# EAGLE schematic Billy-Bass-Board v75 (EAGLE 9.7.0)

## Sheet 1 of 4
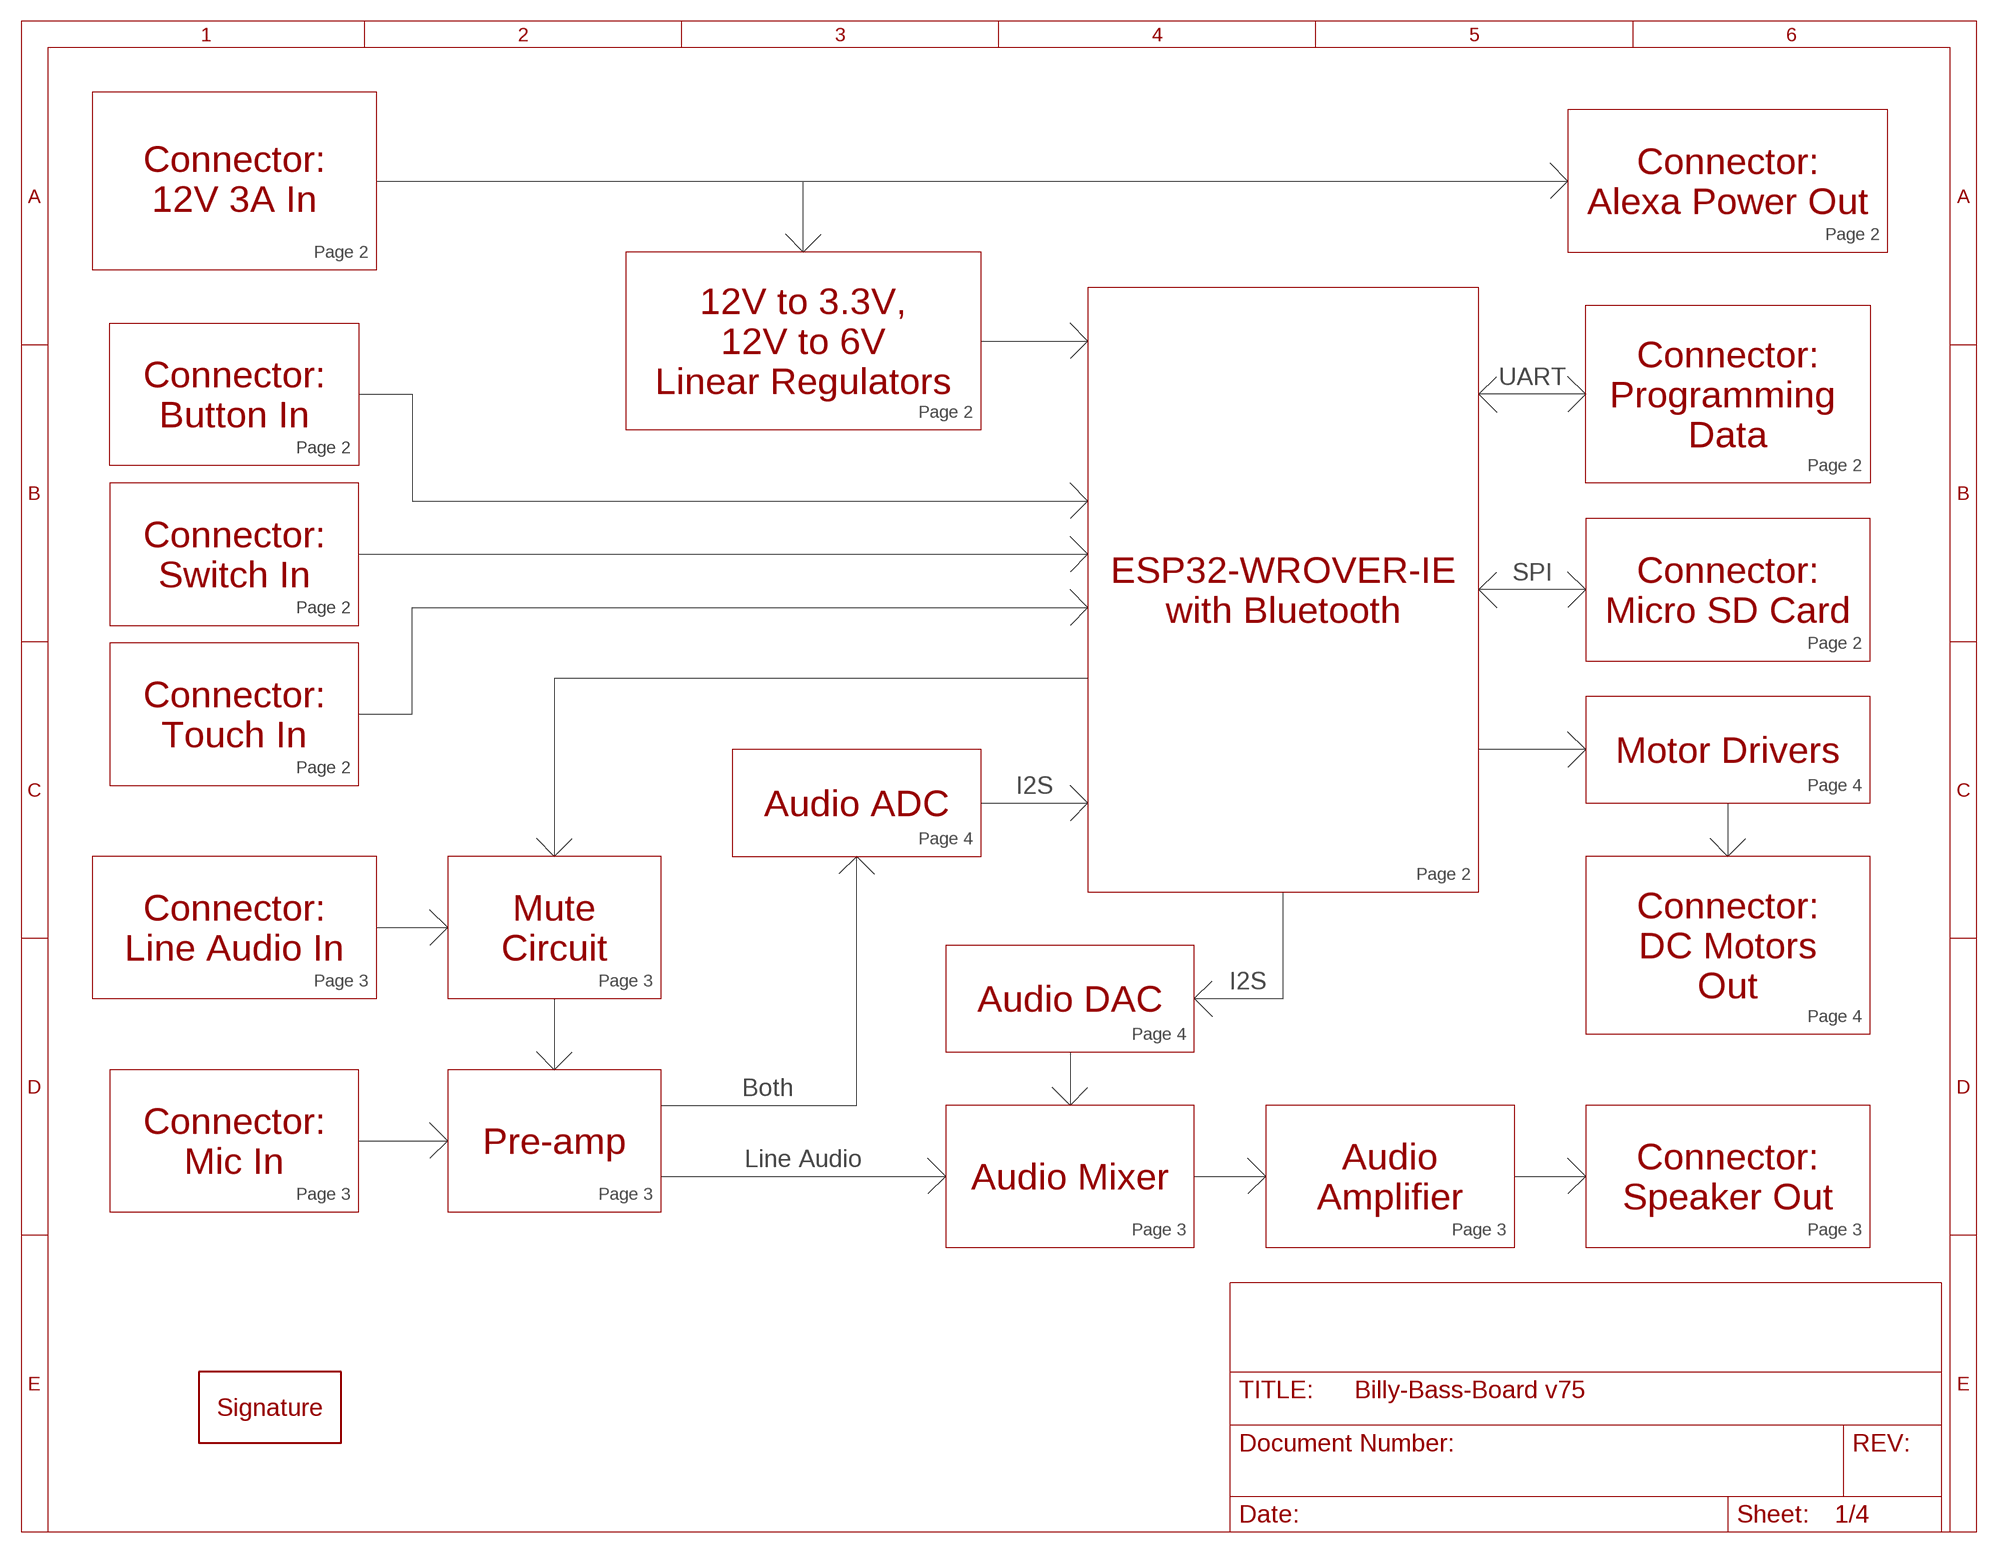
[diagram p0: schematic, sheet 1]

### Parts
U$122  SIGNATURE  [SIGNATURE]

### Notes on the sheet
- Connector:
  Alexa Power Out
- Connector:
  12V 3A In
- Page 2
- Page 2
- 12V to 3.3V,
  12V to 6V
  Linear Regulators
- UART
- Connector:
  Button In
- Connector:
  Programming 
  Data
- Page 2
- Page 2
- Page 2
- Connector:
  Switch In
- SPI
- ESP32-WROVER-IE
  with Bluetooth
- Connector:
  Micro SD Card
- Page 2
- Page 2
- Connector:
  Touch In
- Motor Drivers
- Page 2
- I2S | Page 4
- Audio ADC
- Page 4
- Page 2
- Connector:
  Line Audio In
- Mute
  Circuit
- Connector:
  DC Motors
  Out
- Page 3 | Page 3 | I2S
- Audio DAC
- Page 4
- Page 4
- Both
- Connector:
  Mic In
- Pre-amp
- Line Audio
- Audio Mixer
- Audio
  Amplifier
- Connector:
  Speaker Out
- Page 3 | Page 3
- Page 3 | Page 3 | Page 3

## Sheet 2 of 4
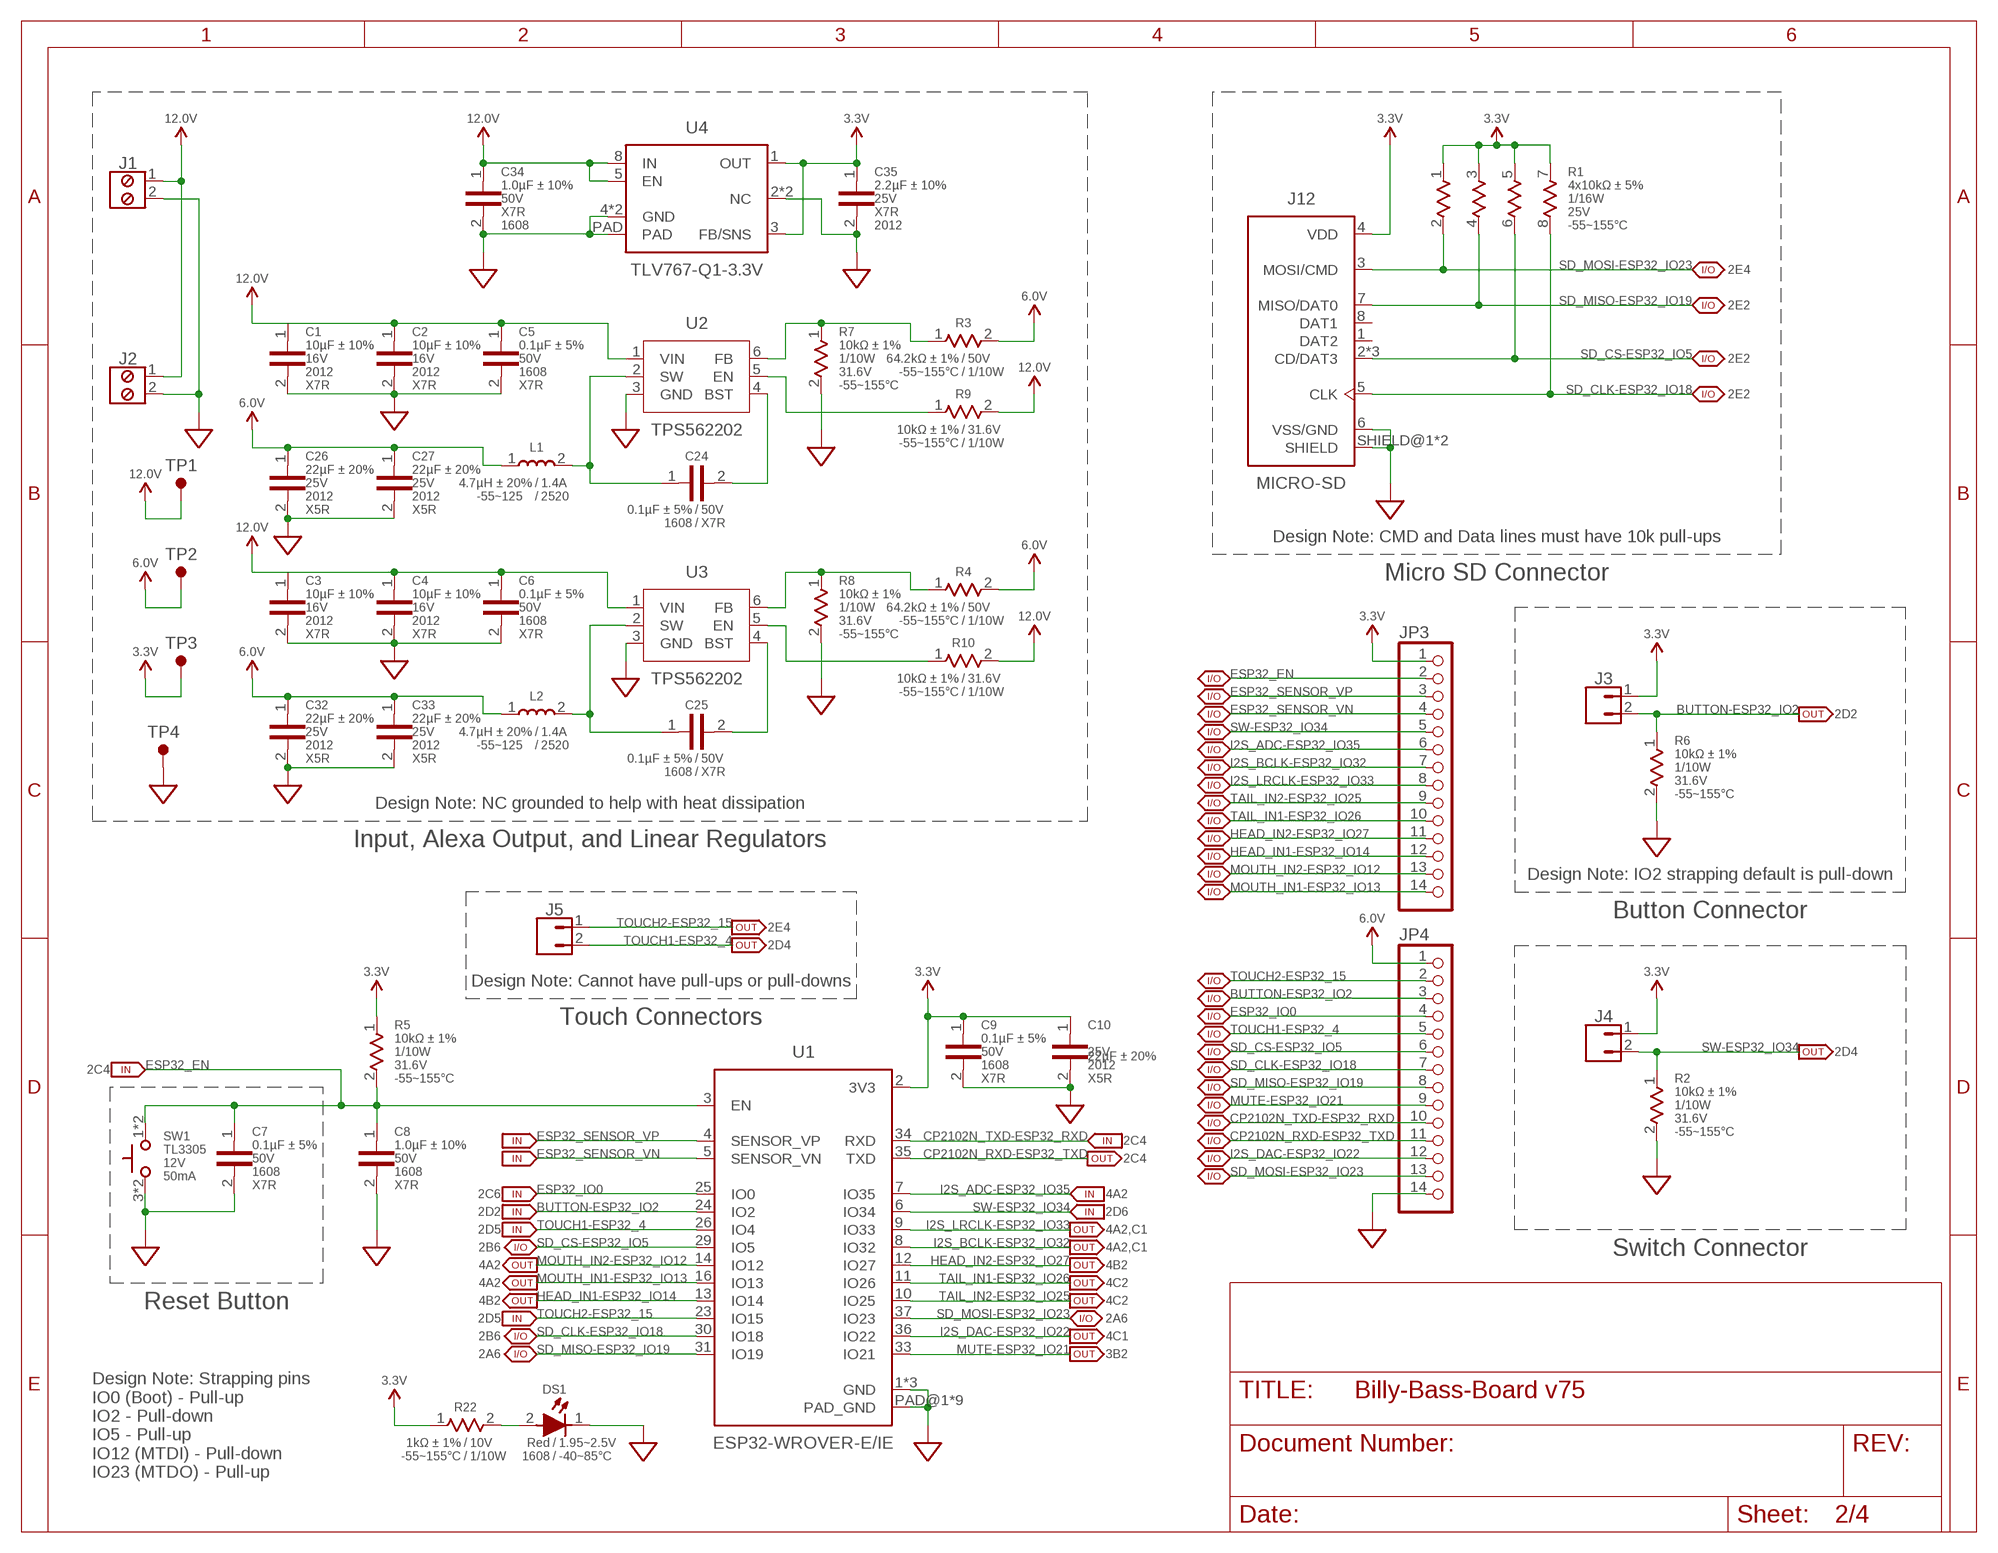
[diagram p1: schematic, sheet 2]

### Parts
C1  10µF ± 10%  CAP-V-10UF-2012  [2012-SEM]
C2  10µF ± 10%  CAP-V-10UF-2012  [2012-SEM]
C3  10µF ± 10%  CAP-V-10UF-2012  [2012-SEM]
C4  10µF ± 10%  CAP-V-10UF-2012  [2012-SEM]
C5  0.1µF ± 5%  CAP-V-0.1UF-1608  [1608-SEM]
C6  0.1µF ± 5%  CAP-V-0.1UF-1608  [1608-SEM]
C7  0.1µF ± 5%  CAP-V-0.1UF-1608  [1608-SEM]
C8  1.0µF ± 10%  CAP-V-1.0UF-1608  [1608-SEM]
C9  0.1µF ± 5%  CAP-V-0.1UF-1608  [1608-SEM]
C10  22µF ± 20%  CAP-V-22UF-2012  [2012-SEM]
C24  0.1µF ± 5%  CAP-H-0.1UF-1608  [1608-SEM]
C25  0.1µF ± 5%  CAP-H-0.1UF-1608  [1608-SEM]
C26  22µF ± 20%  CAP-V-22UF-2012  [2012-SEM]
C27  22µF ± 20%  CAP-V-22UF-2012  [2012-SEM]
C32  22µF ± 20%  CAP-V-22UF-2012  [2012-SEM]
C33  22µF ± 20%  CAP-V-22UF-2012  [2012-SEM]
C34  1.0µF ± 10%  CAP-V-1.0UF-1608  [1608-SEM]
C35  2.2µF ± 10%  CAP-V-2.2UF-2012  [2012-SEM]
DS1  Red  LED-H-RED-1608  [1608]
J1  MPT-2-SCREW  [MPT-0.5/2-2.54]
J2  MPT-2-SCREW  [MPT-0.5/2-2.54]
J3  JST-XH-2  [B2B-XH-A]
J4  JST-XH-2  [B2B-XH-A]
J5  JST-XH-2  [B2B-XH-A]
J12  MICRO-SD  [MEM2061]
JP3  PINHD-1X14  [1X14]
JP4  PINHD-1X14  [1X14]
L1  4.7µH ± 20%  IND-H-4.7U-2520  [2520-SEM]
L2  4.7µH ± 20%  IND-H-4.7U-2520  [2520-SEM]
R1  4x10kΩ ± 5%  RES-V-ARRAY-4P-10K-2010  [2010-4P-SEM]
R2  10kΩ ± 1%  RES-V-10K-1608  [1608-SEM]
R3  64.2kΩ ± 1%  RES-H-64.2K-1608  [1608-SEM]
R4  64.2kΩ ± 1%  RES-H-64.2K-1608  [1608-SEM]
R5  10kΩ ± 1%  RES-V-10K-1608  [1608-SEM]
R6  10kΩ ± 1%  RES-V-10K-1608  [1608-SEM]
R7  10kΩ ± 1%  RES-V-10K-1608  [1608-SEM]
R8  10kΩ ± 1%  RES-V-10K-1608  [1608-SEM]
R9  10kΩ ± 1%  RES-H-10K-1608  [1608-SEM]
R10  10kΩ ± 1%  RES-H-10K-1608  [1608-SEM]
R22  1kΩ ± 1%  RES-H-1K-1608  [1608-SEM]
SW1  TL3305  BUTTON-V-SPST-TL3305  [TL3305]
TP1  TEST-POINT  [TEST-POINT]
TP2  TEST-POINT  [TEST-POINT]
TP3  TEST-POINT  [TEST-POINT]
TP4  TEST-POINT  [TEST-POINT]
U1  ESP32-WROVER-E/IE  [ESP32-WROVER-E/IE]
U2  TPS562202  [SOT563]
U3  TPS562202  [SOT563]
U4  TLV767-Q1-3.3V  [VSON]

### Nets
3.3V: C9.1 C10.1 C35.1 J3.1 J4.1 J12.4(VDD) JP3.1 R1.1 R1.3 R1.5 R1.7 R5.1 R22.1 TP3.TP U1.2(3V3) U4.1(OUT) U4.3(FB/SNS) ; also sheet 3,4
6.0V: C26.1 C27.1 C32.1 C33.1 JP4.1 L1.1 L2.1 R3.2 R4.2 TP2.TP ; also sheet 3,4
12.0V: C1.1 C2.1 C3.1 C4.1 C5.1 C6.1 C34.1 J1.1 J2.1 R9.2 R10.2 TP1.TP U2.1(VIN) U3.1(VIN) U4.5(EN) U4.8(IN)
BUTTON-ESP32_IO2: J3.2 JP4.3 R6.1 U1.24(IO2)
CP2102N_RXD-ESP32_TXD: JP4.11 U1.35(TXD)
CP2102N_TXD-ESP32_RXD: JP4.10 U1.34(RXD)
ESP32_EN: C7.1 C8.1 JP3.2 R5.2 SW1.1 SW1.2 U1.3(EN)
ESP32_IO0: JP4.4 U1.25(IO0)
ESP32_SENSOR_VN: JP3.4 U1.5(SENSOR_VN)
ESP32_SENSOR_VP: JP3.3 U1.4(SENSOR_VP)
GND: C1.2 C2.2 C3.2 C4.2 C5.2 C6.2 C7.2 C8.2 C9.2 C10.2 C26.2 C27.2 C32.2 C33.2 C34.2 C35.2 DS1.1 J1.2 J2.2 J12.6(VSS/GND) J12.SHIELD@1(SHIELD) J12.SHIELD@2(SHIELD) JP4.14 R2.2 R6.2 R7.2 R8.2 SW1.3 SW1.4 TP4.TP U1.1(GND) U1.15(GND) U1.38(GND) U1.PAD@1(PAD_GND) U1.PAD@2(PAD_GND) U1.PAD@3(PAD_GND) U1.PAD@4(PAD_GND) U1.PAD@5(PAD_GND) U1.PAD@6(PAD_GND) U1.PAD@7(PAD_GND) U1.PAD@8(PAD_GND) U1.PAD@9(PAD_GND) U2.3(GND) U3.3(GND) U4.2(NC) U4.4(GND) U4.6(GND) U4.7(NC) U4.PAD ; also sheet 3,4
HEAD_IN1-ESP32_IO14: JP3.12 U1.13(IO14) ; also sheet 4
HEAD_IN2-ESP32_IO27: JP3.11 U1.12(IO27) ; also sheet 4
I2S_ADC-ESP32_IO35: JP3.6 U1.7(IO35) ; also sheet 4
I2S_BCLK-ESP32_IO32: JP3.7 U1.8(IO32) ; also sheet 4
I2S_DAC-ESP32_IO22: JP4.12 U1.36(IO22) ; also sheet 4
I2S_LRCLK-ESP32_IO33: JP3.8 U1.9(IO33) ; also sheet 4
MOUTH_IN1-ESP32_IO13: JP3.14 U1.16(IO13) ; also sheet 4
MOUTH_IN2-ESP32_IO12: JP3.13 U1.14(IO12) ; also sheet 4
MUTE-ESP32_IO21: JP4.9 U1.33(IO21) ; also sheet 3
N$1: DS1.2 R22.2
SD_CLK-ESP32_IO18: J12.5(CLK) JP4.7 R1.8 U1.30(IO18)
SD_CS-ESP32_IO5: J12.2(CD/DAT3) J12.CD@1(CD/DAT3) J12.CD@2(CD/DAT3) JP4.6 R1.6 U1.29(IO5)
SD_MISO-ESP32_IO19: J12.7(MISO/DAT0) JP4.8 R1.4 U1.31(IO19)
SD_MOSI-ESP32_IO23: J12.3(MOSI/CMD) JP4.13 R1.2 U1.37(IO23)
SW-ESP32_IO34: J4.2 JP3.5 R2.1 U1.6(IO34)
TAIL_IN1-ESP32_IO26: JP3.10 U1.11(IO26) ; also sheet 4
TAIL_IN2-ESP32_IO25: JP3.9 U1.10(IO25) ; also sheet 4
TOUCH1-ESP32_4: J5.2 JP4.5 U1.26(IO4)
TOUCH2-ESP32_15: J5.1 JP4.2 U1.23(IO15)
TPS5622021_BST: C24.2 U2.4(BST)
TPS5622021_EN: R9.1 U2.5(EN)
TPS5622021_FB: R3.1 R7.1 U2.6(FB)
TPS5622021_SW: C24.1 L1.2 U2.2(SW)
TPS5622022_BST: C25.2 U3.4(BST)
TPS5622022_EN: R10.1 U3.5(EN)
TPS5622022_FB: R4.1 R8.1 U3.6(FB)
TPS5622022_SW: C25.1 L2.2 U3.2(SW)
Unconnected: J12.1(DAT2) J12.8(DAT1)

### Notes on the sheet
- 2E4
- 2E2
- 2E2
- 2E2
- Design Note: CMD and Data lines must have 10k pull-ups
- Micro SD Connector
- 2D2
- Design Note: NC grounded to help with heat dissipation
- Input, Alexa Output, and Linear Regulators
- Design Note: IO2 strapping default is pull-down
- Button Connector
- 2E4
- 2D4
- Design Note: Cannot have pull-ups or pull-downs
- Touch Connectors
- 2D4
- 2C4
- 2C4
- 2C4
- 2C6 | 4A2
- 2D2 | 2D6
- 2D5 | 4A2,C1
- 2B6 | 4A2,C1 | Switch Connector
- 4A2 | 4B2
- 4A2 | 4C2
- Reset Button | 4B2 | 4C2
- 2D5 | 2A6
- 2B6 | 4C1
- 2A6 | 3B2
- Design Note: Strapping pins
  IO0 (Boot) - Pull-up
  IO2 - Pull-down
  IO5 - Pull-up
  IO12 (MTDI) - Pull-down
  IO23 (MTDO) - Pull-up

## Sheet 3 of 4
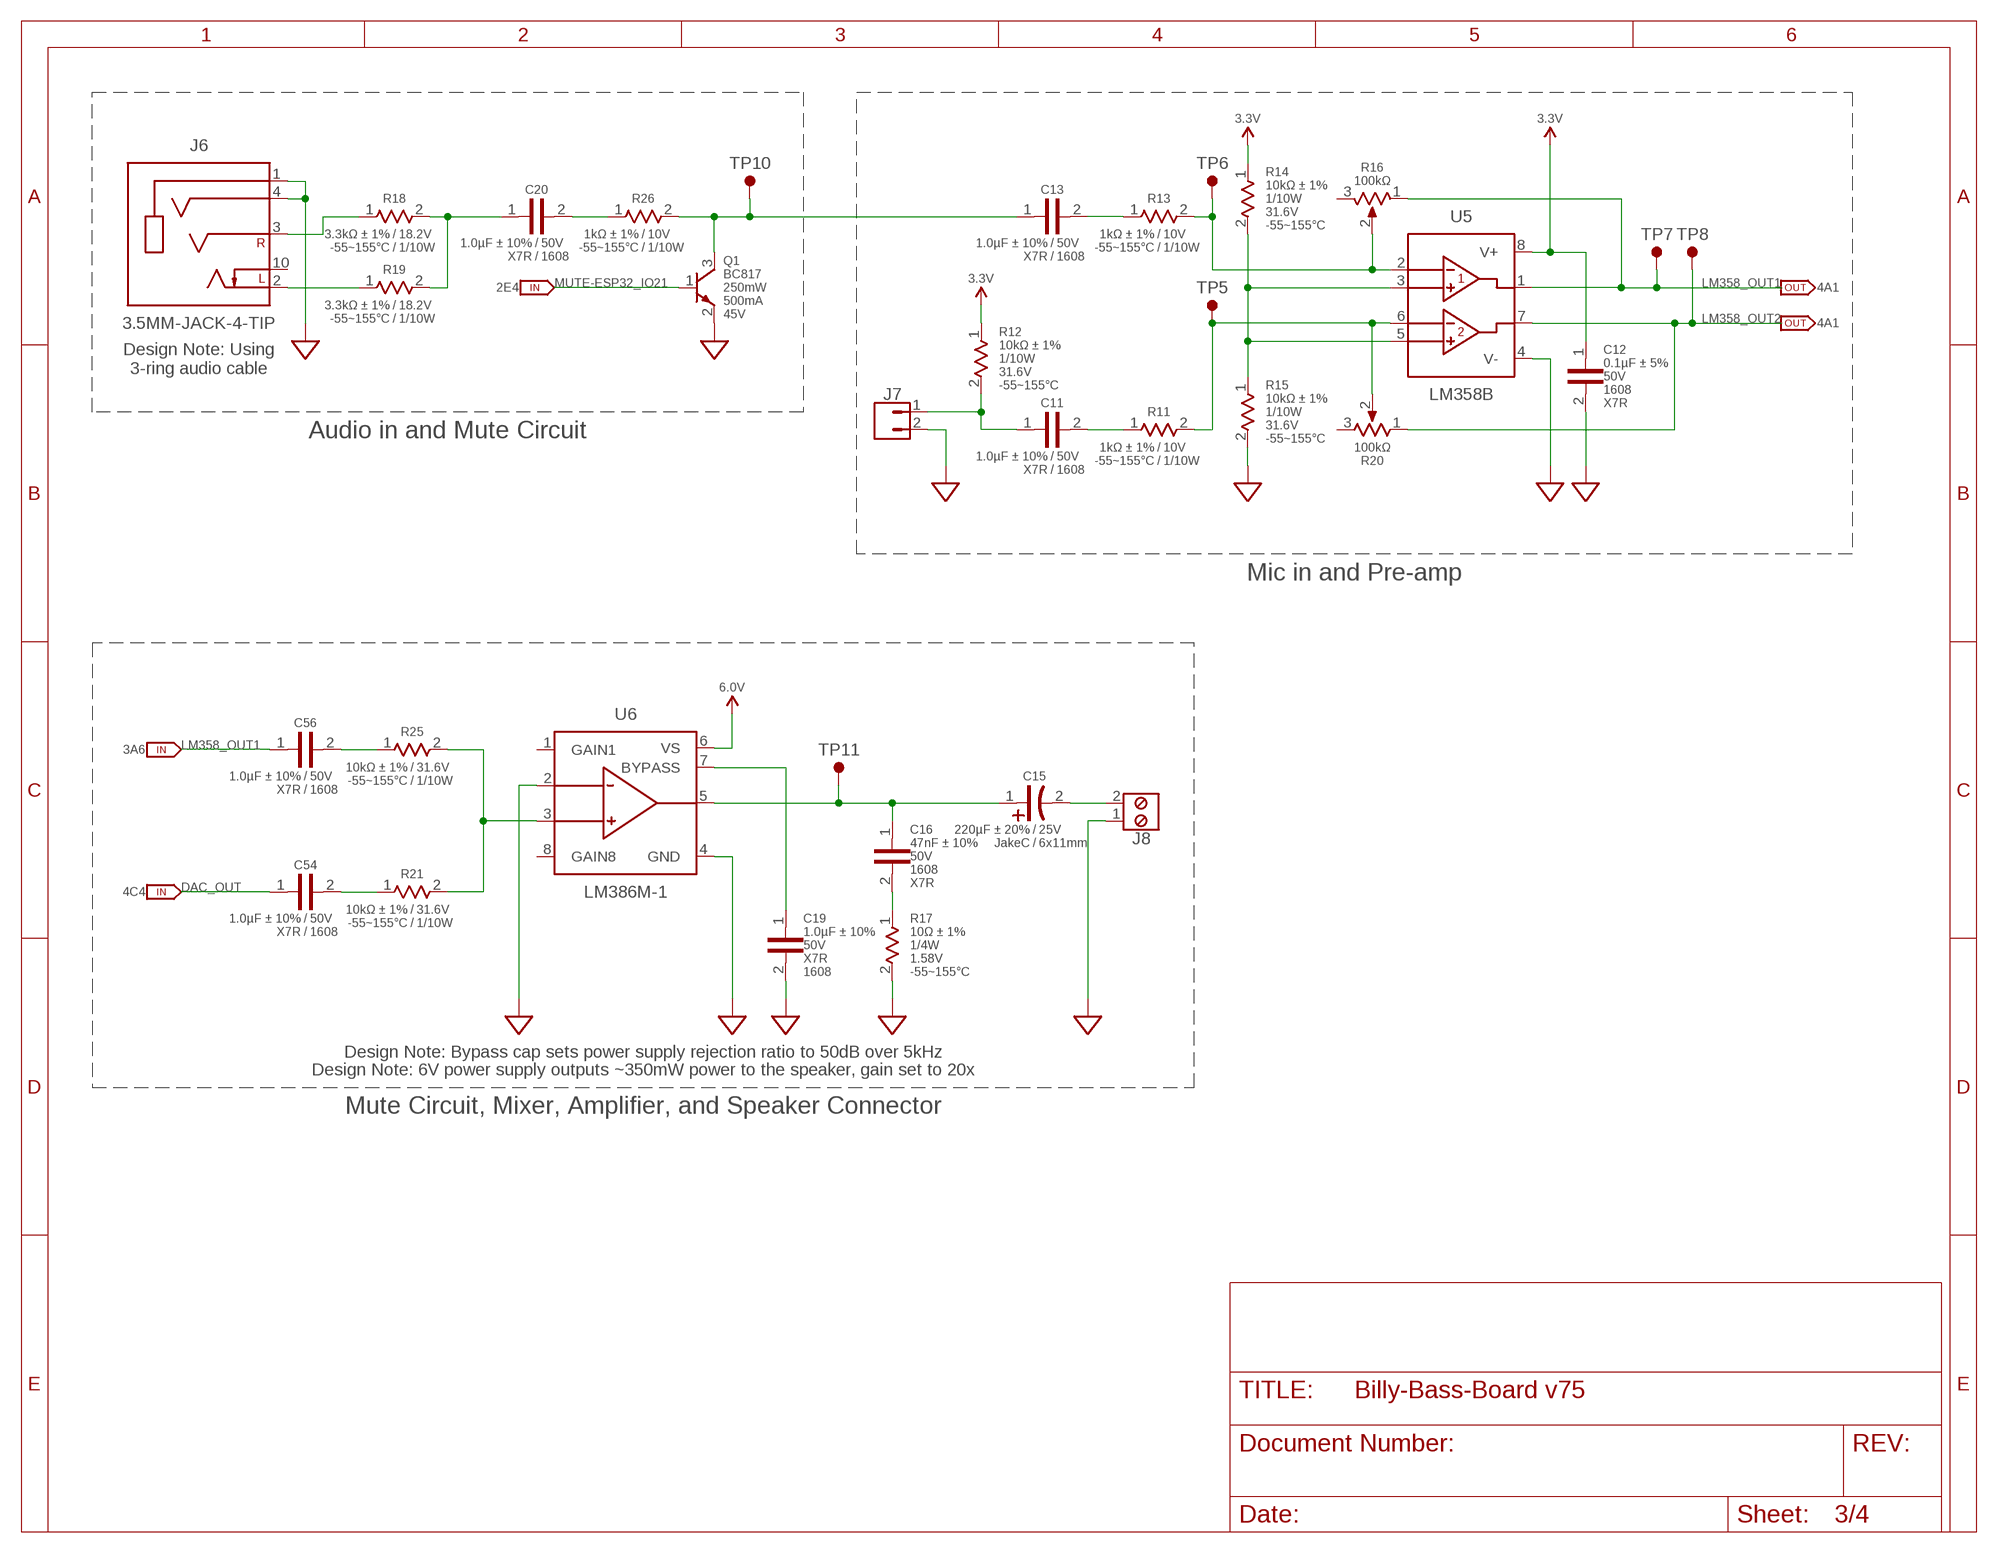
[diagram p2: schematic, sheet 3]

### Parts
C11  1.0µF ± 10%  CAP-H-1.0UF-1608  [1608-SEM]
C12  0.1µF ± 5%  CAP-V-0.1UF-1608  [1608-SEM]
C13  1.0µF ± 10%  CAP-H-1.0UF-1608  [1608-SEM]
C15  220µF ± 20%  CAP-H-POL-220UF-6X11-E-FLAT-REV  [6X11-E-FLAT-REV]
C16  47nF ± 10%  CAP-V-0.047UF-1608  [1608-SEM]
C19  1.0µF ± 10%  CAP-V-1.0UF-1608  [1608-SEM]
C20  1.0µF ± 10%  CAP-H-1.0UF-1608  [1608-SEM]
C54  1.0µF ± 10%  CAP-H-1.0UF-1608  [1608-SEM]
C56  1.0µF ± 10%  CAP-H-1.0UF-1608  [1608-SEM]
J6  3.5MM-JACK-4-TIP  [SJ2-358940-SMT]
J7  JST-XH-2  [B2B-XH-A]
J8  MPT-2-SCREW  [MPT-0.5/2-2.54]
Q1  BC817  BJT-NPN-BC817  [SOT-23-3]
R11  1kΩ ± 1%  RES-H-1K-1608  [1608-SEM]
R12  10kΩ ± 1%  RES-V-10K-1608  [1608-SEM]
R13  1kΩ ± 1%  RES-H-1K-1608  [1608-SEM]
R14  10kΩ ± 1%  RES-V-10K-1608  [1608-SEM]
R15  10kΩ ± 1%  RES-V-10K-1608  [1608-SEM]
R16  100kΩ  TRIMPOT-H-100K  [3314J]
R17  10Ω ± 1%  RES-V-10R-3216  [3216-SEM]
R18  3.3kΩ ± 1%  RES-H-3.3K-1608  [1608-SEM]
R19  3.3kΩ ± 1%  RES-H-3.3K-1608  [1608-SEM]
R20  100kΩ  TRIMPOT-H-100K  [3314J]
R21  10kΩ ± 1%  RES-H-10K-1608  [1608-SEM]
R25  10kΩ ± 1%  RES-H-10K-1608  [1608-SEM]
R26  1kΩ ± 1%  RES-H-1K-1608  [1608-SEM]
TP5  TEST-POINT  [TEST-POINT]
TP6  TEST-POINT  [TEST-POINT]
TP7  TEST-POINT  [TEST-POINT]
TP8  TEST-POINT  [TEST-POINT]
TP10  TEST-POINT  [TEST-POINT]
TP11  TEST-POINT  [TEST-POINT]
U5  LM358B  [D0008A-SOIC]
U6  LM386M-1  [D0008A-SOIC]

### Nets
3.3V: C12.1 R12.1 R14.1 U5.8(V+) ; also sheet 2,4
6.0V: U6.6(VS) ; also sheet 2,4
AUX_LEFT: J6.2(TIP) R19.1
AUX_MIXED: C20.1 R18.2 R19.2
AUX_MUTE: C13.1 Q1.3(C) R26.2 TP10.TP
AUX_RIGHT: J6.3(RING_1) R18.1
DAC_OUT: C54.1 ; also sheet 4
GND: C12.2 C19.2 J6.1(SLEEVE) J6.4(RING_2) J7.2 J8.1 Q1.2(E) R15.2 R17.2 U5.4(V-) U6.2(-INPUT) U6.4(GND) ; also sheet 2,4
LM358_IN1-: R13.2 R16.2 TP6.TP U5.2(IN1-)
LM358_IN2-: R11.2 R20.2 TP5.TP U5.6(IN2-)
LM358_IN+: R14.2 R15.1 U5.3(IN1+) U5.5(IN2+)
LM358_OUT1: C56.1 R16.1 TP7.TP U5.1(OUT1) ; also sheet 4
LM358_OUT2: R20.1 TP8.TP U5.7(OUT2) ; also sheet 4
LM386M_BYPASS: C19.1 U6.7(BYPASS)
LM386M_IN+: R21.2 R25.2 U6.3(+INPUT)
LM386M_OUT: C15.1 C16.1 TP11.TP U6.5(VOUT)
MIC+: C11.1 J7.1 R12.2
MUTE-ESP32_IO21: Q1.1(B) ; also sheet 2
N$2: C54.2 R21.1
N$4: C13.2 R13.1
N$6: C20.2 R26.1
N$8: C56.2 R25.1
N$10: C11.2 R11.1
N$15: C16.2 R17.1
SPEAKER+: C15.2 J8.2
Unconnected: J6.10(TIP_SWITCH) R16.3 R20.3 U6.1(GAIN1) U6.8(GAIN8)

### Notes on the sheet
- 2E4 | 4A1
- 4A1
- Design Note: Using
  3-ring audio cable
- Audio in and Mute Circuit
- Mic in and Pre-amp
- 3A6
- 4C4
- Design Note: Bypass cap sets power supply rejection ratio to 50dB over 5kHz
- Design Note: 6V power supply outputs ~350mW power to the speaker, gain set to 20x
- Mute Circuit, Mixer, Amplifier, and Speaker Connector

## Sheet 4 of 4
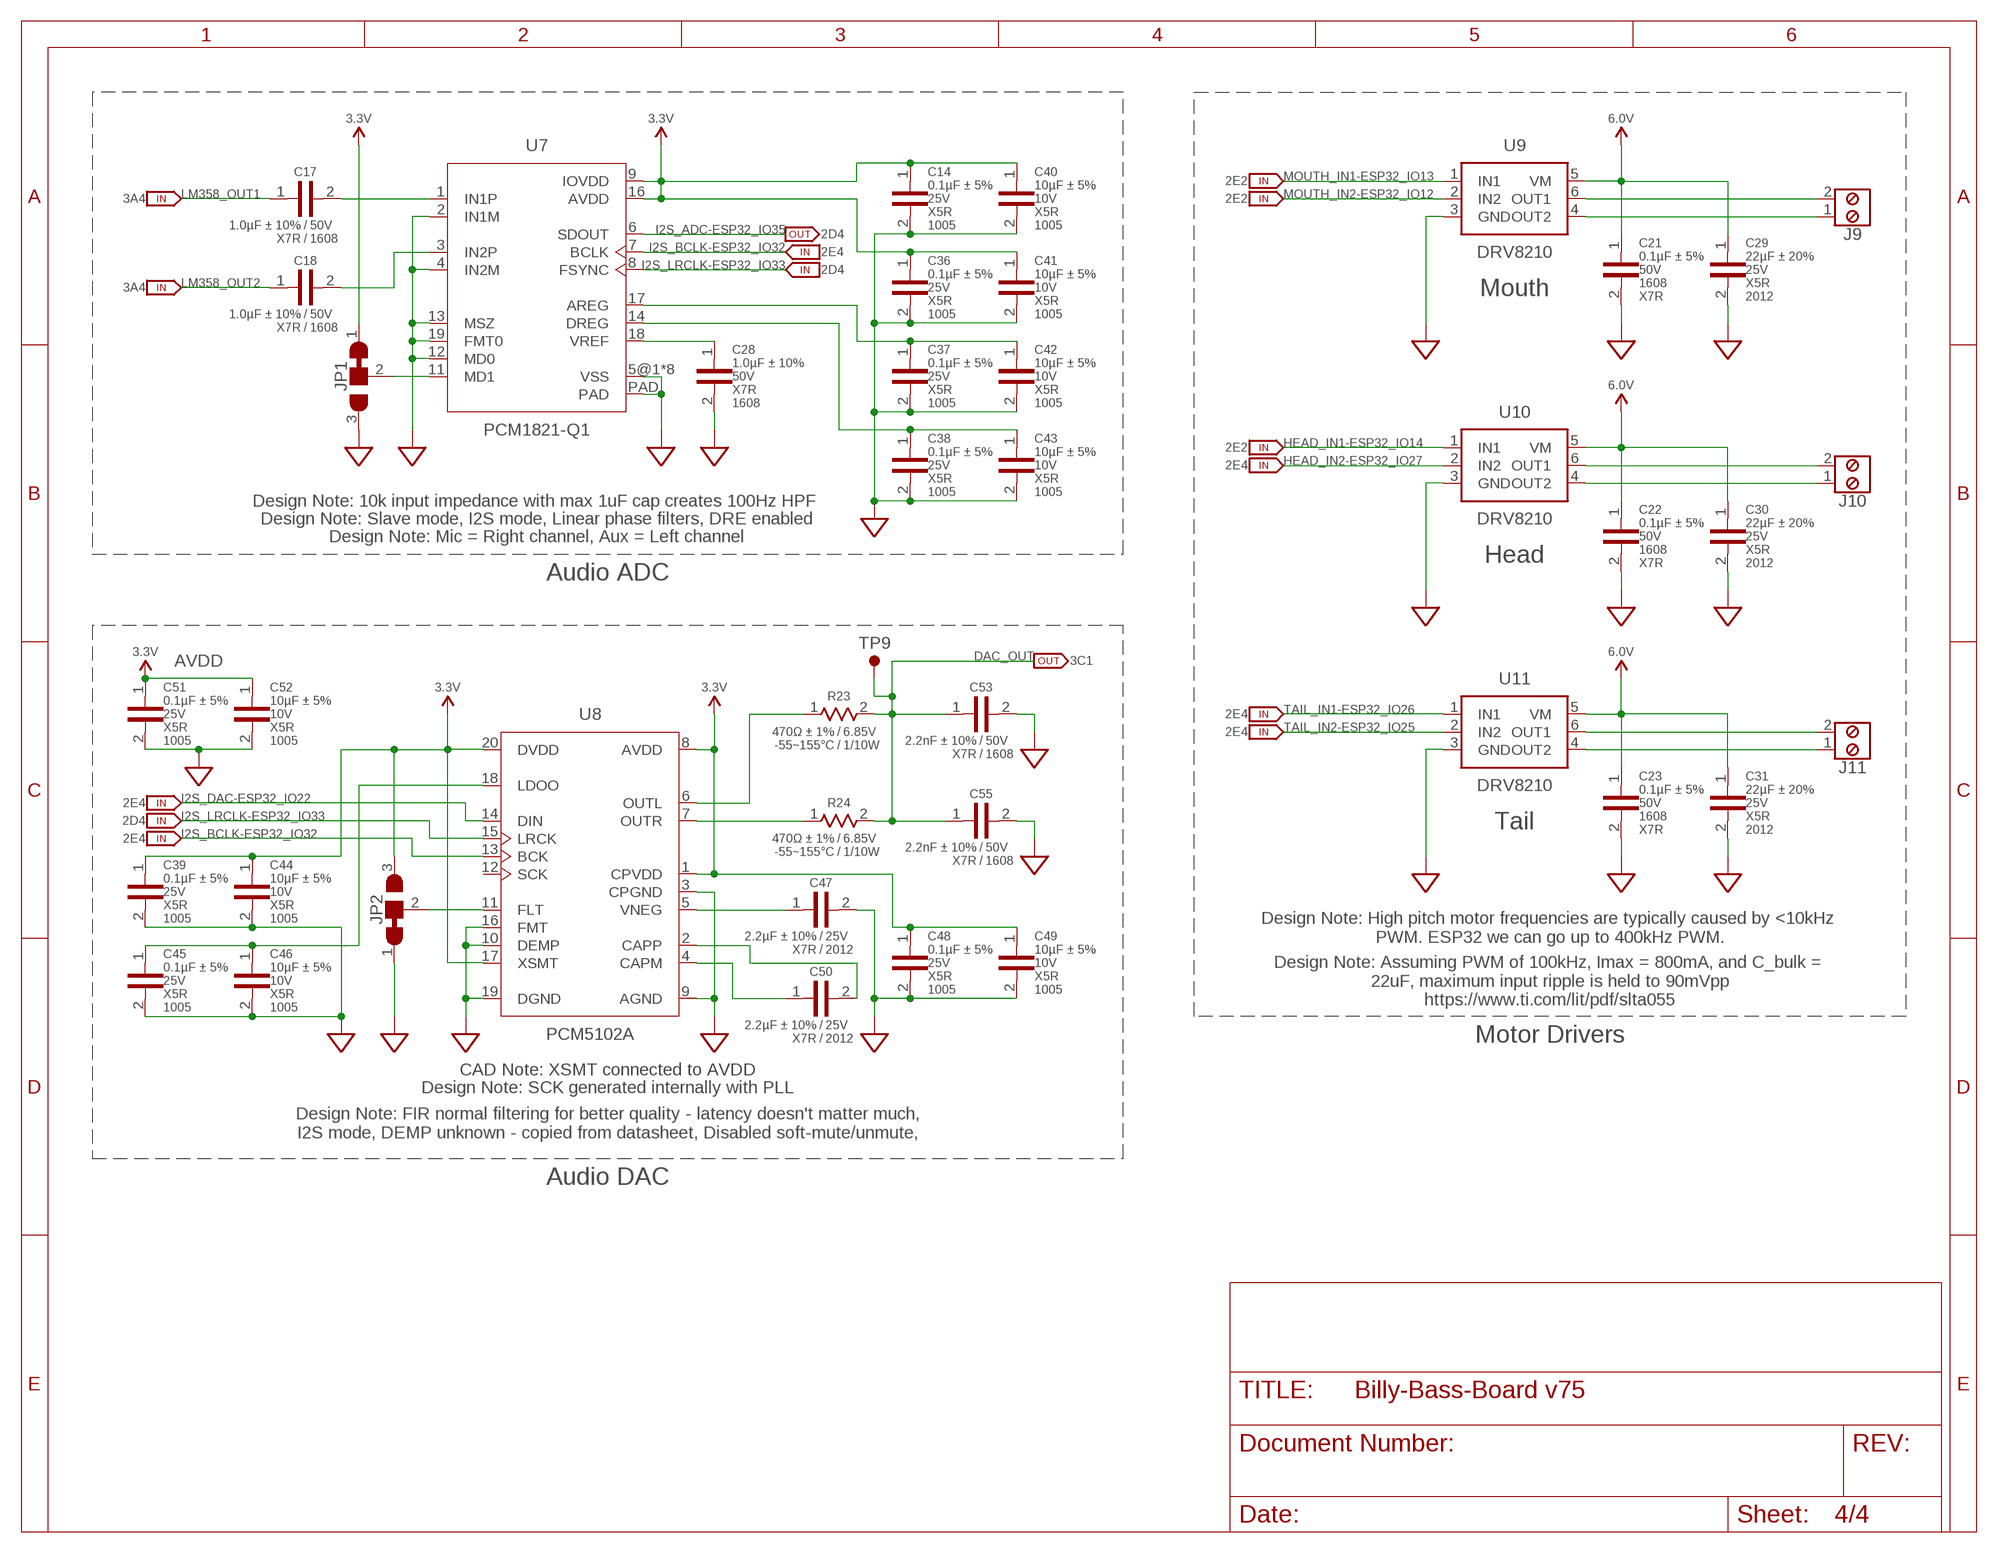
[diagram p3: schematic, sheet 4]

### Parts
C14  0.1µF ± 5%  CAP-V-0.1UF-1005  [1005-SEM]
C17  1.0µF ± 10%  CAP-H-1.0UF-1608  [1608-SEM]
C18  1.0µF ± 10%  CAP-H-1.0UF-1608  [1608-SEM]
C21  0.1µF ± 5%  CAP-V-0.1UF-1608  [1608-SEM]
C22  0.1µF ± 5%  CAP-V-0.1UF-1608  [1608-SEM]
C23  0.1µF ± 5%  CAP-V-0.1UF-1608  [1608-SEM]
C28  1.0µF ± 10%  CAP-V-1.0UF-1608  [1608-SEM]
C29  22µF ± 20%  CAP-V-22UF-2012  [2012-SEM]
C30  22µF ± 20%  CAP-V-22UF-2012  [2012-SEM]
C31  22µF ± 20%  CAP-V-22UF-2012  [2012-SEM]
C36  0.1µF ± 5%  CAP-V-0.1UF-1005  [1005-SEM]
C37  0.1µF ± 5%  CAP-V-0.1UF-1005  [1005-SEM]
C38  0.1µF ± 5%  CAP-V-0.1UF-1005  [1005-SEM]
C39  0.1µF ± 5%  CAP-V-0.1UF-1005  [1005-SEM]
C40  10µF ± 5%  CAP-V-10UF-1005  [1005-SEM]
C41  10µF ± 5%  CAP-V-10UF-1005  [1005-SEM]
C42  10µF ± 5%  CAP-V-10UF-1005  [1005-SEM]
C43  10µF ± 5%  CAP-V-10UF-1005  [1005-SEM]
C44  10µF ± 5%  CAP-V-10UF-1005  [1005-SEM]
C45  0.1µF ± 5%  CAP-V-0.1UF-1005  [1005-SEM]
C46  10µF ± 5%  CAP-V-10UF-1005  [1005-SEM]
C47  2.2µF ± 10%  CAP-H-2.2UF-2012  [2012-SEM]
C48  0.1µF ± 5%  CAP-V-0.1UF-1005  [1005-SEM]
C49  10µF ± 5%  CAP-V-10UF-1005  [1005-SEM]
C50  2.2µF ± 10%  CAP-H-2.2UF-2012  [2012-SEM]
C51  0.1µF ± 5%  CAP-V-0.1UF-1005  [1005-SEM]
C52  10µF ± 5%  CAP-V-10UF-1005  [1005-SEM]
C53  2.2nF ± 10%  CAP-H-0.0022UF-1608  [1608-SEM]
C55  2.2nF ± 10%  CAP-H-0.0022UF-1608  [1608-SEM]
J9  MPT-2-SCREW  [MPT-0.5/2-2.54]
J10  MPT-2-SCREW  [MPT-0.5/2-2.54]
J11  MPT-2-SCREW  [MPT-0.5/2-2.54]
JP1  JUMPER-2-BRIDGED-1  [JUMPER-PAD-2-BRIDGED-1]
JP2  JUMPER-2-BRIDGED-1  [JUMPER-PAD-2-BRIDGED-1]
R23  470Ω ± 1%  RES-H-470R-1608  [1608-SEM]
R24  470Ω ± 1%  RES-H-470R-1608  [1608-SEM]
TP9  TEST-POINT  [TEST-POINT]
U7  PCM1821-Q1  [WQFN]
U8  PCM5102A  [TSSOP-20]
U9  DRV8210  [SOT563]
U10  DRV8210  [SOT563]
U11  DRV8210  [SOT563]

### Nets
3.3V: C14.1 C36.1 C39.1 C40.1 C41.1 C44.1 C48.1 C49.1 C51.1 C52.1 JP1.1 JP2.3 U7.9(IOVDD) U7.16(AVDD) U8.1(CPVDD) U8.8(AVDD) U8.17(XSMT) U8.20(DVDD) ; also sheet 2,3
6.0V: C21.1 C22.1 C23.1 C29.1 C30.1 C31.1 U9.5(VM) U10.5(VM) U11.5(VM) ; also sheet 2,3
DAC_OUT: C53.1 C55.1 R23.2 R24.2 TP9.TP ; also sheet 3
DRV82101_OUT1: J9.2 U9.6(OUT1)
DRV82101_OUT2: J9.1 U9.4(OUT2)
DRV82102_OUT1: J10.2 U10.6(OUT1)
DRV82102_OUT2: J10.1 U10.4(OUT2)
DRV82103_OUT1: J11.2 U11.6(OUT1)
DRV82103_OUT2: J11.1 U11.4(OUT2)
GND: C14.2 C21.2 C22.2 C23.2 C28.2 C29.2 C30.2 C31.2 C36.2 C37.2 C38.2 C39.2 C40.2 C41.2 C42.2 C43.2 C44.2 C45.2 C46.2 C47.2 C48.2 C49.2 C51.2 C52.2 C53.2 C55.2 JP1.3 JP2.1 U7.2(IN1M) U7.4(IN2M) U7.5@1(VSS) U7.5@2(VSS) U7.10@1(VSS) U7.10@2(VSS) U7.12(MD0) U7.13(MSZ) U7.15@1(VSS) U7.15@2(VSS) U7.19(FMT0) U7.20@1(VSS) U7.20@2(VSS) U7.PAD U8.3(CPGND) U8.9(AGND) U8.10(DEMP) U8.16(FMT) U8.19(DGND) U9.3(GND) U10.3(GND) U11.3(GND) ; also sheet 2,3
HEAD_IN1-ESP32_IO14: U10.1(IN1) ; also sheet 2
HEAD_IN2-ESP32_IO27: U10.2(IN2) ; also sheet 2
I2S_ADC-ESP32_IO35: U7.6(SDOUT) ; also sheet 2
I2S_BCLK-ESP32_IO32: U7.7(BCLK) U8.13(BCK) ; also sheet 2
I2S_DAC-ESP32_IO22: U8.14(DIN) ; also sheet 2
I2S_LRCLK-ESP32_IO33: U7.8(FSYNC) U8.15(LRCK) ; also sheet 2
LM358_OUT1: C17.1 ; also sheet 3
LM358_OUT2: C18.1 ; also sheet 3
MOUTH_IN1-ESP32_IO13: U9.1(IN1) ; also sheet 2
MOUTH_IN2-ESP32_IO12: U9.2(IN2) ; also sheet 2
N$3: JP1.2 U7.11(MD1)
PCM1821_AREG: C37.1 C42.1 U7.17(AREG)
PCM1821_DREG: C38.1 C43.1 U7.14(DREG)
PCM1821_IN1P: C17.2 U7.1(IN1P)
PCM1821_IN2P: C18.2 U7.3(IN2P)
PCM1821_VREF: C28.1 U7.18(VREF)
PCM5102A_CAPM: C50.1 U8.4(CAPM)
PCM5102A_CAPP: C50.2 U8.2(CAPP)
PCM5102A_FLT: JP2.2 U8.11(FLT)
PCM5102A_LDOO: C45.1 C46.1 U8.18(LDOO)
PCM5102A_OUTL: R23.1 U8.6(OUTL)
PCM5102A_OUTR: R24.1 U8.7(OUTR)
PCM5102A_VNEG: C47.1 U8.5(VNEG)
TAIL_IN1-ESP32_IO26: U11.1(IN1) ; also sheet 2
TAIL_IN2-ESP32_IO25: U11.2(IN2) ; also sheet 2
Unconnected: U8.12(SCK)

### Notes on the sheet
- 2E2
- 3A4 | 2E2
- 2D4
- 2E4
- 2D4
- 3A4 | Mouth
- 2E2
- 2E4
- Design Note: 10k input impedance with max 1uF cap creates 100Hz HPF
- Design Note: Slave mode, I2S mode, Linear phase filters, DRE enabled
- Design Note: Mic = Right channel, Aux = Left channel
- Head
- Audio ADC
- AVDD | 3C1
- 2E4
- 2E4
- 2E4
- 2D4 | Tail
- 2E4
- Design Note: High pitch motor frequencies are typically caused by <10kHz 
  PWM. ESP32 we can go up to 400kHz PWM.
- Design Note: Assuming PWM of 100kHz, Imax = 800mA, and C_bulk = 
  22uF, maximum input ripple is held to 90mVpp
  https://www.ti.com/lit/pdf/slta055
- Motor Drivers
- CAD Note: XSMT connected to AVDD
- Design Note: SCK generated internally with PLL
- Design Note: FIR normal filtering for better quality - latency doesn't matter much,
  I2S mode, DEMP unknown - copied from datasheet, Disabled soft-mute/unmute,
- Audio DAC

## Library data of the parts
C1-C4 = Harrington-Capacitors:CAP-V: Ceramic Capacitors - Vertical; SIZE: 2012; TEMPERATURE: X7R; VOLTAGE: 16V
C5-C9 C12 C16 C19 C21-C23 C28 C34 = Harrington-Capacitors:CAP-V: Ceramic Capacitors - Vertical; SIZE: 1608; TEMPERATURE: X7R; VOLTAGE: 50V
C10 C26 C27 C29-C33 = Harrington-Capacitors:CAP-V: Ceramic Capacitors - Vertical; SIZE: 2012; TEMPERATURE: X5R; VOLTAGE: 25V
C11 C13 C17 C18 C20 C24 C25 C53-C56 = Harrington-Capacitors:CAP-H: Ceramic Capacitors SEM - Horizontal; SIZE: 1608; TEMPERATURE: X7R; VOLTAGE: 50V
C14 C36-C39 C45 C48 C51 = Harrington-Capacitors:CAP-V: Ceramic Capacitors - Vertical; SIZE: 1005; TEMPERATURE: X5R; VOLTAGE: 25V
C15 = Harrington-Capacitors:CAP-H-POL: Polarized Capacitors - Horizontal; SIZE: 6x11mm; TEMPERATURE: JakeC; VOLTAGE: 25V
C35 = Harrington-Capacitors:CAP-V: Ceramic Capacitors - Vertical; SIZE: 2012; TEMPERATURE: X7R; VOLTAGE: 25V
C40-C44 C46 C49 C52 = Harrington-Capacitors:CAP-V: Ceramic Capacitors - Vertical; SIZE: 1005; TEMPERATURE: X5R; VOLTAGE: 10V
C47 C50 = Harrington-Capacitors:CAP-H: Ceramic Capacitors SEM - Horizontal; SIZE: 2012; TEMPERATURE: X7R; VOLTAGE: 25V
DS1 = Harrington-Diodes:LED-H: LEDs Kingbright - Horizontal; SIZE: 1608; TEMPERATURE: -40~85°C; VOLTAGE: 1.95~2.5V
J1 J2 J8-J11 = Harrington-Connectors:MPT-2-SCREW: 2-pin MPT Screw Connector Phoenix Contact - Max Voltage: 160V - Max Current: 6A
J3-J5 J7 = Harrington-Connectors:JST-XH-2: 2-pin XH Connector JST - Max Voltage: 250V - Max Current: 3A
J6 = Harrington-Connectors:3.5MM-JACK-4-TIP: 4-pin 3.5mm Jack with tip swtich CUI Devices - Max Voltage: 12V - Max Current: 1A
J12 = Harrington-Connectors:MICRO-SD: Micro-SD Connector GCT - CD = GND when not inserted
JP1 JP2 = Harrington-Connectors:JUMPER-2-BRIDGED-1: Jumper Pad Dual Connection - One Bridged, One Open
JP3 JP4 = pinhead:PINHD-1X14: PIN HEADER
L1 L2 = Harrington-Inductors:IND-H; CURRENT: 1.4A; SIZE: 2520; TEMPERATURE: -55~125℃
Q1 = Harrington-Transistors:BJT-NPN: NPN BJTs; IC_MAX: 500mA; POWER: 250mW; VCE_MAX: 45V
R1 = Harrington-Resistors:RES-V-ARRAY-4P: Resistor Array 4-Piece Samsung Electromechanics - Vertical; POWER: 1/16W; TEMPERATURE: -55~155°C; VOLTAGE: 25V
R2 R5-R8 R12 R14 R15 = Harrington-Resistors:RES-V: Resistors Samsung Electromechanics - Vertical; POWER: 1/10W; TEMPERATURE: -55~155°C; VOLTAGE: 31.6V
R3 R4 = Harrington-Resistors:RES-H: Resistors Samsung Electromechanics - Horizontal; POWER: 1/10W; TEMPERATURE: -55~155°C; VOLTAGE: 50V
R9 R10 R21 R25 = Harrington-Resistors:RES-H: Resistors Samsung Electromechanics - Horizontal; POWER: 1/10W; TEMPERATURE: -55~155°C; VOLTAGE: 31.6V
R11 R13 R22 R26 = Harrington-Resistors:RES-H: Resistors Samsung Electromechanics - Horizontal; POWER: 1/10W; TEMPERATURE: -55~155°C; VOLTAGE: 10V
R16 R20 = Harrington-Resistors:TRIMPOT-H: Trimming Potentiometers Bourns - Horizontal
R17 = Harrington-Resistors:RES-V: Resistors Samsung Electromechanics - Vertical; POWER: 1/4W; TEMPERATURE: -55~155°C; VOLTAGE: 1.58V
R18 R19 = Harrington-Resistors:RES-H: Resistors Samsung Electromechanics - Horizontal; POWER: 1/10W; TEMPERATURE: -55~155°C; VOLTAGE: 18.2V
R23 R24 = Harrington-Resistors:RES-H: Resistors Samsung Electromechanics - Horizontal; POWER: 1/10W; TEMPERATURE: -55~155°C; VOLTAGE: 6.85V
SW1 = Harrington-Switches:BUTTON-V-SPST: SPST Button E-Switch - Vertical; I_MAX: 50mA; V_MAX: 12V
TP1-TP11 = Harrington-Symbols:TEST-POINT: Test point
U1 = Harrington-ICs:ESP32-WROVER-E/IE: ESP32-WROVER-E/IE Espressif - ESP32 with 8MB PSRAM
U2 U3 = Harrington-ICs:TPS562202: DC-DC Buck Converter Texas Instruments - Input Voltage: 4.3-17V - Output Voltage: 0.804-7V - Max Current: 2A
U4 = Harrington-ICs:TLV767-Q1: Linear Regulator Texas Instruments - Input Voltage: 2.5-16V - Output Voltage: 0.8-14.6V - Max Current: 1A
U5 = Harrington-ICs:LM358B: Dual Op-amp Texas Instruments - Voltage Rails: 3-36V - Gain Bandwidth Product: 1.2MHz
U6 = Harrington-ICs:LM386: Audio Power Amplifier Texas Instruments - Voltage Rails: 4-12V
U7 = Harrington-ICs:PCM1821-Q1: Audio I2S ADC Texas Instruments - Sterio / 2-channel - 32bit PCM
U8 = Harrington-ICs:PCM5102A: Audio I2S DAC Texas Instruments - Sterio / 2-channel - 32bit PCM
U9-U11 = Harrington-ICs:DRV8210: H-Bridge Motor Driver Texas Instruments - Drive Voltage: 1.65 - 11V - Signal Voltage: 1.65 - 5.5V - Max Current: 1.76A
U$122 = Harrington-Aesthetics:SIGNATURE: PCB Signature